# EAGLE design 5-de-7 (EAGLE 6.6.0)
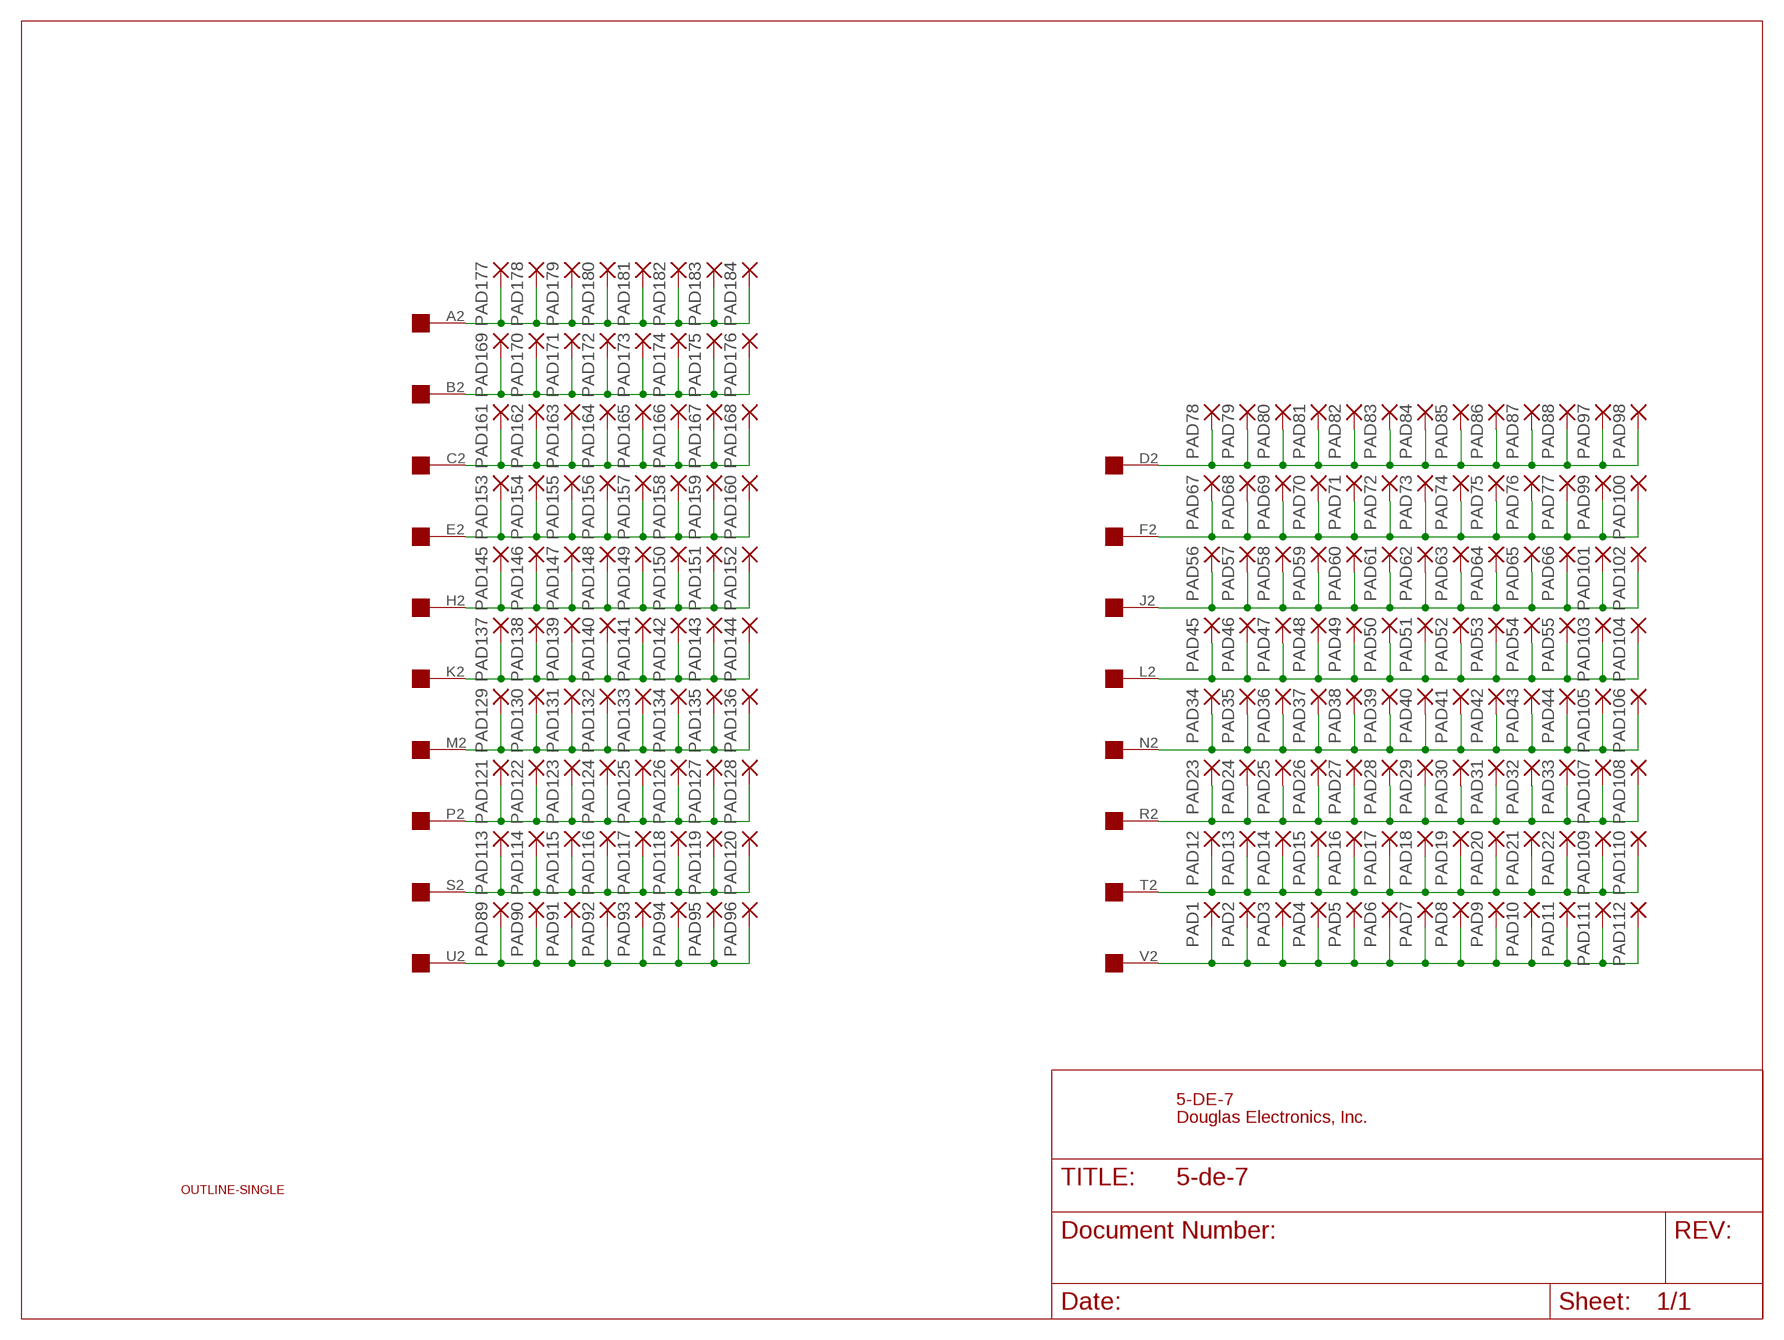
[diagram p0: schematic, sheet 1]

## Parts
PAD1  2,54/1,1  [2,54/1,1]
PAD2  2,54/1,1  [2,54/1,1]
PAD3  2,54/1,1  [2,54/1,1]
PAD4  2,54/1,1  [2,54/1,1]
PAD5  2,54/1,1  [2,54/1,1]
PAD6  2,54/1,1  [2,54/1,1]
PAD7  2,54/1,1  [2,54/1,1]
PAD8  2,54/1,1  [2,54/1,1]
PAD9  2,54/1,1  [2,54/1,1]
PAD10  2,54/1,1  [2,54/1,1]
PAD11  2,54/1,1  [2,54/1,1]
PAD12  2,54/1,1  [2,54/1,1]
PAD13  2,54/1,1  [2,54/1,1]
PAD14  2,54/1,1  [2,54/1,1]
PAD15  2,54/1,1  [2,54/1,1]
PAD16  2,54/1,1  [2,54/1,1]
PAD17  2,54/1,1  [2,54/1,1]
PAD18  2,54/1,1  [2,54/1,1]
PAD19  2,54/1,1  [2,54/1,1]
PAD20  2,54/1,1  [2,54/1,1]
PAD21  2,54/1,1  [2,54/1,1]
PAD22  2,54/1,1  [2,54/1,1]
PAD23  2,54/1,1  [2,54/1,1]
PAD24  2,54/1,1  [2,54/1,1]
PAD25  2,54/1,1  [2,54/1,1]
PAD26  2,54/1,1  [2,54/1,1]
PAD27  2,54/1,1  [2,54/1,1]
PAD28  2,54/1,1  [2,54/1,1]
PAD29  2,54/1,1  [2,54/1,1]
PAD30  2,54/1,1  [2,54/1,1]
PAD31  2,54/1,1  [2,54/1,1]
PAD32  2,54/1,1  [2,54/1,1]
PAD33  2,54/1,1  [2,54/1,1]
PAD34  2,54/1,1  [2,54/1,1]
PAD35  2,54/1,1  [2,54/1,1]
PAD36  2,54/1,1  [2,54/1,1]
PAD37  2,54/1,1  [2,54/1,1]
PAD38  2,54/1,1  [2,54/1,1]
PAD39  2,54/1,1  [2,54/1,1]
PAD40  2,54/1,1  [2,54/1,1]
PAD41  2,54/1,1  [2,54/1,1]
PAD42  2,54/1,1  [2,54/1,1]
PAD43  2,54/1,1  [2,54/1,1]
PAD44  2,54/1,1  [2,54/1,1]
PAD45  2,54/1,1  [2,54/1,1]
PAD46  2,54/1,1  [2,54/1,1]
PAD47  2,54/1,1  [2,54/1,1]
PAD48  2,54/1,1  [2,54/1,1]
PAD49  2,54/1,1  [2,54/1,1]
PAD50  2,54/1,1  [2,54/1,1]
PAD51  2,54/1,1  [2,54/1,1]
PAD52  2,54/1,1  [2,54/1,1]
PAD53  2,54/1,1  [2,54/1,1]
PAD54  2,54/1,1  [2,54/1,1]
PAD55  2,54/1,1  [2,54/1,1]
PAD56  2,54/1,1  [2,54/1,1]
PAD57  2,54/1,1  [2,54/1,1]
PAD58  2,54/1,1  [2,54/1,1]
PAD59  2,54/1,1  [2,54/1,1]
PAD60  2,54/1,1  [2,54/1,1]
PAD61  2,54/1,1  [2,54/1,1]
PAD62  2,54/1,1  [2,54/1,1]
PAD63  2,54/1,1  [2,54/1,1]
PAD64  2,54/1,1  [2,54/1,1]
PAD65  2,54/1,1  [2,54/1,1]
PAD66  2,54/1,1  [2,54/1,1]
PAD67  2,54/1,1  [2,54/1,1]
PAD68  2,54/1,1  [2,54/1,1]
PAD69  2,54/1,1  [2,54/1,1]
PAD70  2,54/1,1  [2,54/1,1]
PAD71  2,54/1,1  [2,54/1,1]
PAD72  2,54/1,1  [2,54/1,1]
PAD73  2,54/1,1  [2,54/1,1]
PAD74  2,54/1,1  [2,54/1,1]
PAD75  2,54/1,1  [2,54/1,1]
PAD76  2,54/1,1  [2,54/1,1]
PAD77  2,54/1,1  [2,54/1,1]
PAD78  2,54/1,1  [2,54/1,1]
PAD79  2,54/1,1  [2,54/1,1]
PAD80  2,54/1,1  [2,54/1,1]
PAD81  2,54/1,1  [2,54/1,1]
PAD82  2,54/1,1  [2,54/1,1]
PAD83  2,54/1,1  [2,54/1,1]
PAD84  2,54/1,1  [2,54/1,1]
PAD85  2,54/1,1  [2,54/1,1]
PAD86  2,54/1,1  [2,54/1,1]
PAD87  2,54/1,1  [2,54/1,1]
PAD88  2,54/1,1  [2,54/1,1]
PAD89  2,54/1,1  [2,54/1,1]
PAD90  2,54/1,1  [2,54/1,1]
PAD91  2,54/1,1  [2,54/1,1]
PAD92  2,54/1,1  [2,54/1,1]
PAD93  2,54/1,1  [2,54/1,1]
PAD94  2,54/1,1  [2,54/1,1]
PAD95  2,54/1,1  [2,54/1,1]
PAD96  2,54/1,1  [2,54/1,1]
PAD97  2,54/1,1  [2,54/1,1]
PAD98  2,54/1,1  [2,54/1,1]
PAD99  2,54/1,1  [2,54/1,1]
PAD100  2,54/1,1  [2,54/1,1]
PAD101  2,54/1,1  [2,54/1,1]
PAD102  2,54/1,1  [2,54/1,1]
PAD103  2,54/1,1  [2,54/1,1]
PAD104  2,54/1,1  [2,54/1,1]
PAD105  2,54/1,1  [2,54/1,1]
PAD106  2,54/1,1  [2,54/1,1]
PAD107  2,54/1,1  [2,54/1,1]
PAD108  2,54/1,1  [2,54/1,1]
PAD109  2,54/1,1  [2,54/1,1]
PAD110  2,54/1,1  [2,54/1,1]
PAD111  2,54/1,1  [2,54/1,1]
PAD112  2,54/1,1  [2,54/1,1]
PAD113  2,54/1,1  [2,54/1,1]
PAD114  2,54/1,1  [2,54/1,1]
PAD115  2,54/1,1  [2,54/1,1]
PAD116  2,54/1,1  [2,54/1,1]
PAD117  2,54/1,1  [2,54/1,1]
PAD118  2,54/1,1  [2,54/1,1]
PAD119  2,54/1,1  [2,54/1,1]
PAD120  2,54/1,1  [2,54/1,1]
PAD121  2,54/1,1  [2,54/1,1]
PAD122  2,54/1,1  [2,54/1,1]
PAD123  2,54/1,1  [2,54/1,1]
PAD124  2,54/1,1  [2,54/1,1]
PAD125  2,54/1,1  [2,54/1,1]
PAD126  2,54/1,1  [2,54/1,1]
PAD127  2,54/1,1  [2,54/1,1]
PAD128  2,54/1,1  [2,54/1,1]
PAD129  2,54/1,1  [2,54/1,1]
PAD130  2,54/1,1  [2,54/1,1]
PAD131  2,54/1,1  [2,54/1,1]
PAD132  2,54/1,1  [2,54/1,1]
PAD133  2,54/1,1  [2,54/1,1]
PAD134  2,54/1,1  [2,54/1,1]
PAD135  2,54/1,1  [2,54/1,1]
PAD136  2,54/1,1  [2,54/1,1]
PAD137  2,54/1,1  [2,54/1,1]
PAD138  2,54/1,1  [2,54/1,1]
PAD139  2,54/1,1  [2,54/1,1]
PAD140  2,54/1,1  [2,54/1,1]
PAD141  2,54/1,1  [2,54/1,1]
PAD142  2,54/1,1  [2,54/1,1]
PAD143  2,54/1,1  [2,54/1,1]
PAD144  2,54/1,1  [2,54/1,1]
PAD145  2,54/1,1  [2,54/1,1]
PAD146  2,54/1,1  [2,54/1,1]
PAD147  2,54/1,1  [2,54/1,1]
PAD148  2,54/1,1  [2,54/1,1]
PAD149  2,54/1,1  [2,54/1,1]
PAD150  2,54/1,1  [2,54/1,1]
PAD151  2,54/1,1  [2,54/1,1]
PAD152  2,54/1,1  [2,54/1,1]
PAD153  2,54/1,1  [2,54/1,1]
PAD154  2,54/1,1  [2,54/1,1]
PAD155  2,54/1,1  [2,54/1,1]
PAD156  2,54/1,1  [2,54/1,1]
PAD157  2,54/1,1  [2,54/1,1]
PAD158  2,54/1,1  [2,54/1,1]
PAD159  2,54/1,1  [2,54/1,1]
PAD160  2,54/1,1  [2,54/1,1]
PAD161  2,54/1,1  [2,54/1,1]
PAD162  2,54/1,1  [2,54/1,1]
PAD163  2,54/1,1  [2,54/1,1]
PAD164  2,54/1,1  [2,54/1,1]
PAD165  2,54/1,1  [2,54/1,1]
PAD166  2,54/1,1  [2,54/1,1]
PAD167  2,54/1,1  [2,54/1,1]
PAD168  2,54/1,1  [2,54/1,1]
PAD169  2,54/1,1  [2,54/1,1]
PAD170  2,54/1,1  [2,54/1,1]
PAD171  2,54/1,1  [2,54/1,1]
PAD172  2,54/1,1  [2,54/1,1]
PAD173  2,54/1,1  [2,54/1,1]
PAD174  2,54/1,1  [2,54/1,1]
PAD175  2,54/1,1  [2,54/1,1]
PAD176  2,54/1,1  [2,54/1,1]
PAD177  2,54/1,1  [2,54/1,1]
PAD178  2,54/1,1  [2,54/1,1]
PAD179  2,54/1,1  [2,54/1,1]
PAD180  2,54/1,1  [2,54/1,1]
PAD181  2,54/1,1  [2,54/1,1]
PAD182  2,54/1,1  [2,54/1,1]
PAD183  2,54/1,1  [2,54/1,1]
PAD184  2,54/1,1  [2,54/1,1]
U$2  OUTLINE-SINGLE  [SINGLE]
U$3  EDGE-1  [EDGE-CON1]

## Nets
A [abcehkmpsu]: PAD177.1(P) PAD178.1(P) PAD179.1(P) PAD180.1(P) PAD181.1(P) PAD182.1(P) PAD183.1(P) PAD184.1(P) U$3.A2
B [abcehkmpsu]: PAD169.1(P) PAD170.1(P) PAD171.1(P) PAD172.1(P) PAD173.1(P) PAD174.1(P) PAD175.1(P) PAD176.1(P) U$3.B2
C [abcehkmpsu]: PAD161.1(P) PAD162.1(P) PAD163.1(P) PAD164.1(P) PAD165.1(P) PAD166.1(P) PAD167.1(P) PAD168.1(P) U$3.C2
D: PAD78.1(P) PAD79.1(P) PAD80.1(P) PAD81.1(P) PAD82.1(P) PAD83.1(P) PAD84.1(P) PAD85.1(P) PAD86.1(P) PAD87.1(P) PAD88.1(P) PAD97.1(P) PAD98.1(P) U$3.D2
E [abcehkmpsu]: PAD153.1(P) PAD154.1(P) PAD155.1(P) PAD156.1(P) PAD157.1(P) PAD158.1(P) PAD159.1(P) PAD160.1(P) U$3.E2
F: PAD67.1(P) PAD68.1(P) PAD69.1(P) PAD70.1(P) PAD71.1(P) PAD72.1(P) PAD73.1(P) PAD74.1(P) PAD75.1(P) PAD76.1(P) PAD77.1(P) PAD99.1(P) PAD100.1(P) U$3.F2
H [abcehkmpsu]: PAD145.1(P) PAD146.1(P) PAD147.1(P) PAD148.1(P) PAD149.1(P) PAD150.1(P) PAD151.1(P) PAD152.1(P) U$3.H2
J: PAD56.1(P) PAD57.1(P) PAD58.1(P) PAD59.1(P) PAD60.1(P) PAD61.1(P) PAD62.1(P) PAD63.1(P) PAD64.1(P) PAD65.1(P) PAD66.1(P) PAD101.1(P) PAD102.1(P) U$3.J2
K [abcehkmpsu]: PAD137.1(P) PAD138.1(P) PAD139.1(P) PAD140.1(P) PAD141.1(P) PAD142.1(P) PAD143.1(P) PAD144.1(P) U$3.K2
L: PAD45.1(P) PAD46.1(P) PAD47.1(P) PAD48.1(P) PAD49.1(P) PAD50.1(P) PAD51.1(P) PAD52.1(P) PAD53.1(P) PAD54.1(P) PAD55.1(P) PAD103.1(P) PAD104.1(P) U$3.L2
M [abcehkmpsu]: PAD129.1(P) PAD130.1(P) PAD131.1(P) PAD132.1(P) PAD133.1(P) PAD134.1(P) PAD135.1(P) PAD136.1(P) U$3.M2
N: PAD34.1(P) PAD35.1(P) PAD36.1(P) PAD37.1(P) PAD38.1(P) PAD39.1(P) PAD40.1(P) PAD41.1(P) PAD42.1(P) PAD43.1(P) PAD44.1(P) PAD105.1(P) PAD106.1(P) U$3.N2
P [abcehkmpsu]: PAD121.1(P) PAD122.1(P) PAD123.1(P) PAD124.1(P) PAD125.1(P) PAD126.1(P) PAD127.1(P) PAD128.1(P) U$3.P2
R: PAD23.1(P) PAD24.1(P) PAD25.1(P) PAD26.1(P) PAD27.1(P) PAD28.1(P) PAD29.1(P) PAD30.1(P) PAD31.1(P) PAD32.1(P) PAD33.1(P) PAD107.1(P) PAD108.1(P) U$3.R2
S [abcehkmpsu]: PAD113.1(P) PAD114.1(P) PAD115.1(P) PAD116.1(P) PAD117.1(P) PAD118.1(P) PAD119.1(P) PAD120.1(P) U$3.S2
T: PAD12.1(P) PAD13.1(P) PAD14.1(P) PAD15.1(P) PAD16.1(P) PAD17.1(P) PAD18.1(P) PAD19.1(P) PAD20.1(P) PAD21.1(P) PAD22.1(P) PAD109.1(P) PAD110.1(P) U$3.T2
U [abcehkmpsu]: PAD89.1(P) PAD90.1(P) PAD91.1(P) PAD92.1(P) PAD93.1(P) PAD94.1(P) PAD95.1(P) PAD96.1(P) U$3.U2
V: PAD1.1(P) PAD2.1(P) PAD3.1(P) PAD4.1(P) PAD5.1(P) PAD6.1(P) PAD7.1(P) PAD8.1(P) PAD9.1(P) PAD10.1(P) PAD11.1(P) PAD111.1(P) PAD112.1(P) U$3.V2

## Notes on the sheet
- 5-DE-7
- Douglas Electronics, Inc.

## Library data of the parts
PAD1-PAD184 = wirepad:2,54/1,1: THROUGH-HOLE PAD
U$2 = dec-con:OUTLINE-*: Board outlines for DEC boards.
U$3 = dec-con:EDGE-1: Single-Sided DEC Edge Connector -- (side 2)

## Net classes
0 default: width 0.762 mm
1 abcehkmpsu: width 1.016 mm

## Board
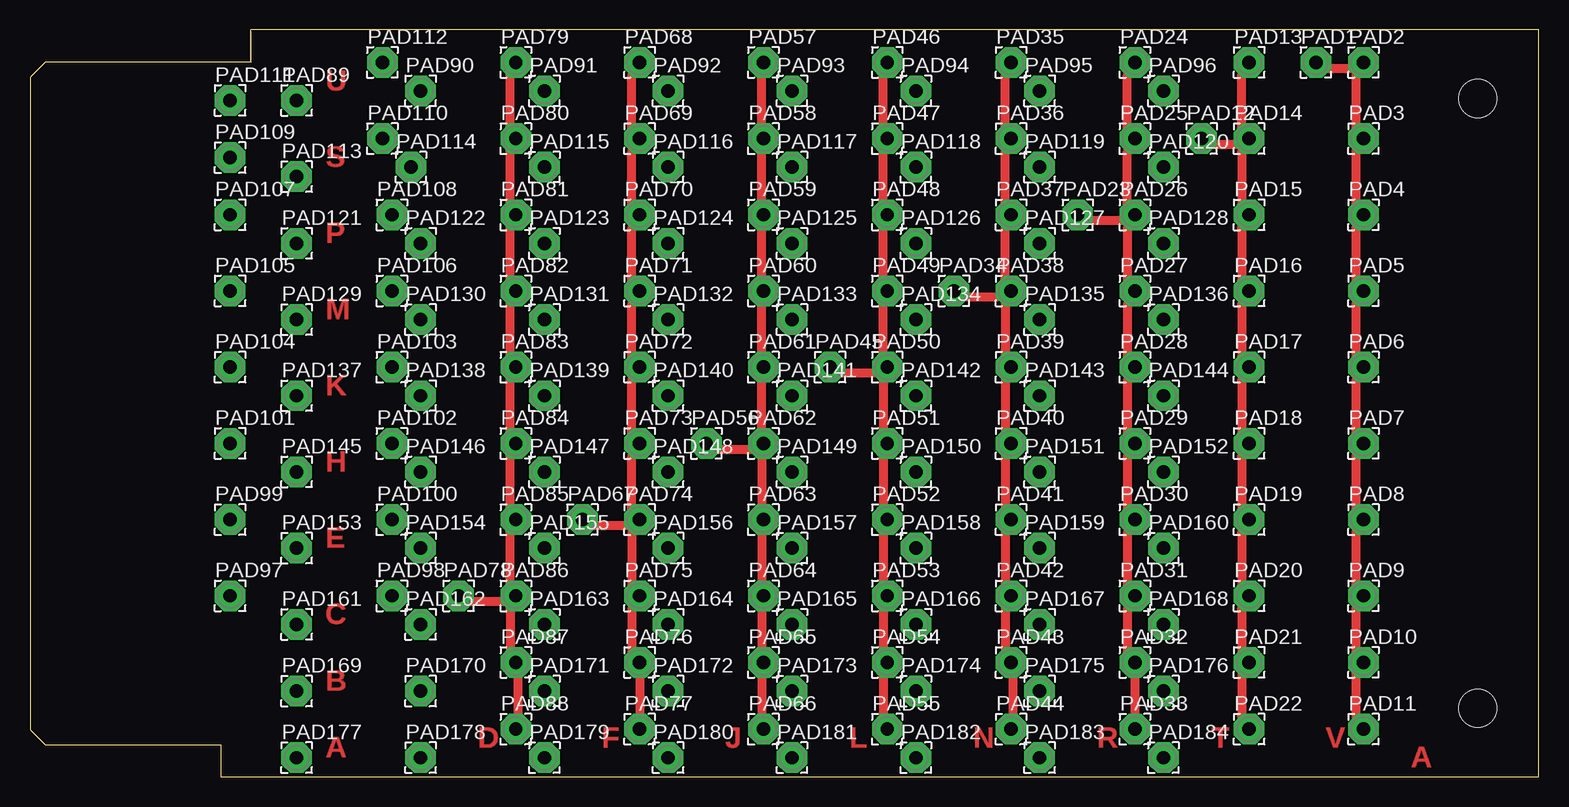
[diagram p1: board, top side]
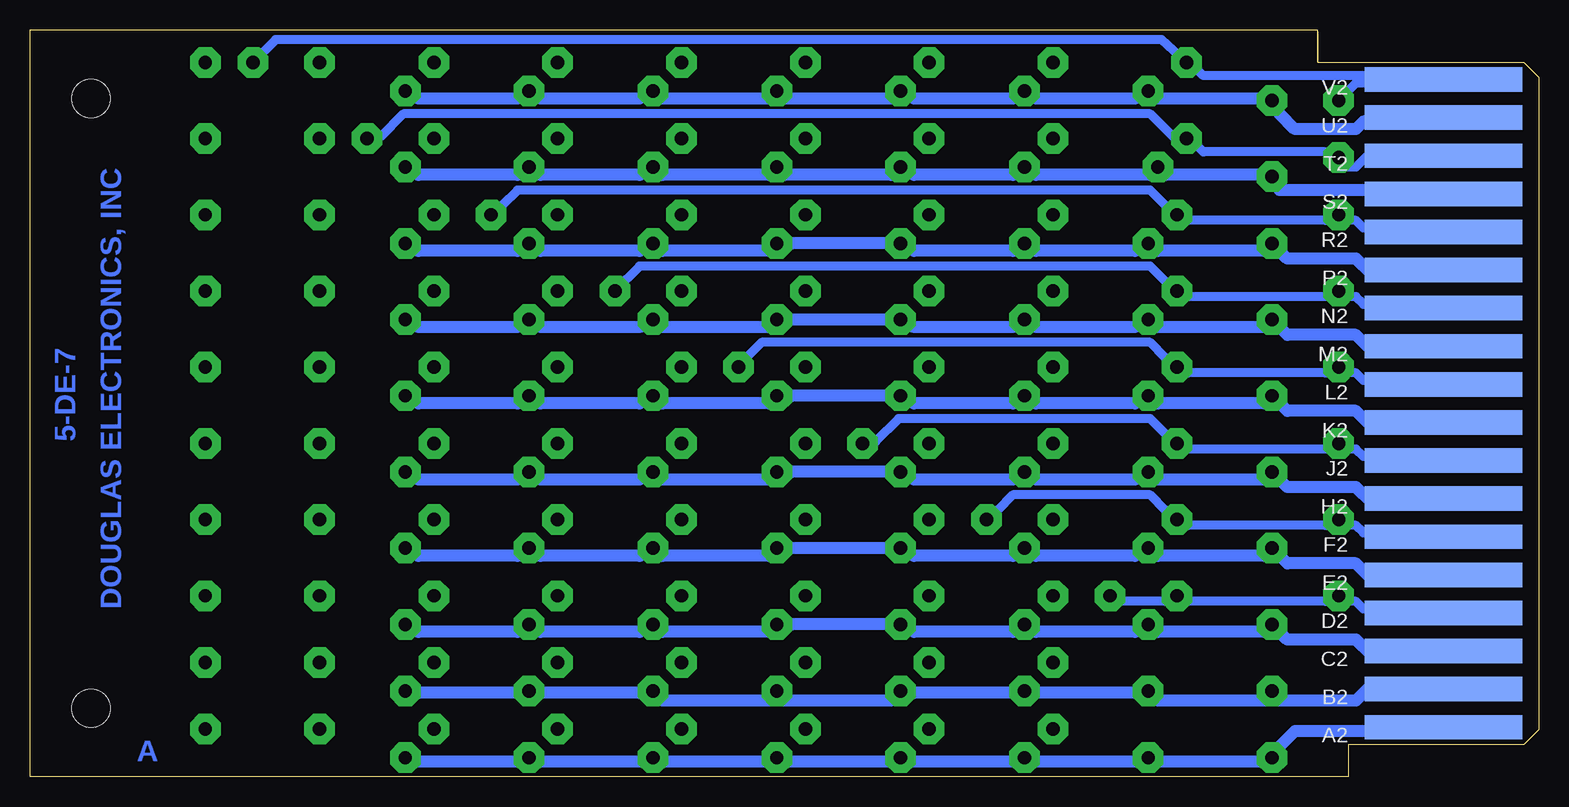
[diagram p2: board, bottom side, seen from below]

Size 125.73 x 62.23 mm. Coordinates in mm from the lower left corner, seen from the top.
Copper layers (1*16): Top 0.035mm / dielectric 1.5mm / Bottom 0.035mm
Design rules "default": minimum track width 10mil, minimum drill 24mil, track to track 8mil, track to pad 8mil, pad to pad 8mil, via to via 8mil, smd to smd 8mil, copper to edge 10mil, drill to drill 8mil, minimum pad ring 10mil, minimum via ring 8mil, stop-mask expansion 4mil, vias tented up to drill 0mil, thermal gap 10mil

### Footprints (pad centres in the part's own frame; a part is rotated, then mirrored left to right if it is on the bottom)
2,54/1,1 = drill 1.118 pad 2.54 octagon: 1 0,0
SINGLE = hole 3.175: 120.65,56.515; 120.65,5.715
EDGE-CON1 = smd 13.106 x 2.032 bottom: A2 7.938,4.128; B2 7.938,7.303; C2 7.938,10.477; D2 7.938,13.652; E2 7.938,16.828; F2 7.938,20.003; H2 7.938,23.177; J2 7.938,26.352; K2 7.938,29.527; L2 7.938,32.703; M2 7.938,35.877; N2 7.938,39.053; P2 7.938,42.227; R2 7.938,45.403; S2 7.938,48.578; T2 7.938,51.752; U2 7.938,54.928; V2 7.938,58.102

### Placement (x,y rotation side)
PAD1  107.16,59.53 0 top
PAD2  111.13,59.53 0 top
PAD3  111.13,53.18 0 top
PAD4  111.13,46.83 0 top
PAD5  111.13,40.48 0 top
PAD6  111.13,34.13 0 top
PAD7  111.13,27.78 0 top
PAD8  111.13,21.43 0 top
PAD9  111.13,15.08 0 top
PAD10  111.13,9.53 0 top
PAD11  111.13,3.97 0 top
PAD12  97.63,53.18 0 top
PAD13  101.6,59.53 0 top
PAD14  101.6,53.18 0 top
PAD15  101.6,46.83 0 top
PAD16  101.6,40.48 0 top
PAD17  101.6,34.13 0 top
PAD18  101.6,27.78 0 top
PAD19  101.6,21.43 0 top
PAD20  101.6,15.08 0 top
PAD21  101.6,9.53 0 top
PAD22  101.6,3.97 0 top
PAD23  87.31,46.83 0 top
PAD24  92.08,59.53 0 top
PAD25  92.08,53.18 0 top
PAD26  92.08,46.83 0 top
PAD27  92.08,40.48 0 top
PAD28  92.08,34.13 0 top
PAD29  92.08,27.78 0 top
PAD30  92.08,21.43 0 top
PAD31  92.08,15.08 0 top
PAD32  92.08,9.53 0 top
PAD33  92.08,3.97 0 top
PAD34  76.99,40.48 0 top
PAD35  81.76,59.53 0 top
PAD36  81.76,53.18 0 top
PAD37  81.76,46.83 0 top
PAD38  81.76,40.48 0 top
PAD39  81.76,34.13 0 top
PAD40  81.76,27.78 0 top
PAD41  81.76,21.43 0 top
PAD42  81.76,15.08 0 top
PAD43  81.76,9.53 0 top
PAD44  81.76,3.97 0 top
PAD45  66.68,34.13 0 top
PAD46  71.44,59.53 0 top
PAD47  71.44,53.18 0 top
PAD48  71.44,46.83 0 top
PAD49  71.44,40.48 0 top
PAD50  71.44,34.13 0 top
PAD51  71.44,27.78 0 top
PAD52  71.44,21.43 0 top
PAD53  71.44,15.08 0 top
PAD54  71.44,9.53 0 top
PAD55  71.44,3.97 0 top
PAD56  56.36,27.78 0 top
PAD57  61.12,59.53 0 top
PAD58  61.12,53.18 0 top
PAD59  61.12,46.83 0 top
PAD60  61.12,40.48 0 top
PAD61  61.12,34.13 0 top
PAD62  61.12,27.78 0 top
PAD63  61.12,21.43 0 top
PAD64  61.12,15.08 0 top
PAD65  61.12,9.53 0 top
PAD66  61.12,3.97 0 top
PAD67  46.04,21.43 0 top
PAD68  50.8,59.53 0 top
PAD69  50.8,53.18 0 top
PAD70  50.8,46.83 0 top
PAD71  50.8,40.48 0 top
PAD72  50.8,34.13 0 top
PAD73  50.8,27.78 0 top
PAD74  50.8,21.43 0 top
PAD75  50.8,15.08 0 top
PAD76  50.8,9.53 0 top
PAD77  50.8,3.97 0 top
PAD78  35.72,15.08 0 top
PAD79  40.48,59.53 0 top
PAD80  40.48,53.18 0 top
PAD81  40.48,46.83 0 top
PAD82  40.48,40.48 0 top
PAD83  40.48,34.13 0 top
PAD84  40.48,27.78 0 top
PAD85  40.48,21.43 0 top
PAD86  40.48,15.08 0 top
PAD87  40.48,9.53 0 top
PAD88  40.48,3.97 0 top
PAD89  22.23,56.36 0 top
PAD90  32.54,57.15 0 top
PAD91  42.86,57.15 0 top
PAD92  53.18,57.15 0 top
PAD93  63.5,57.15 0 top
PAD94  73.82,57.15 0 top
PAD95  84.14,57.15 0 top
PAD96  94.46,57.15 0 top
PAD97  16.67,15.08 0 top
PAD98  30.16,15.08 0 top
PAD99  16.67,21.43 0 top
PAD100  30.16,21.43 0 top
PAD101  16.67,27.78 0 top
PAD102  30.16,27.78 0 top
PAD103  30.16,34.13 0 top
PAD104  16.67,34.13 0 top
PAD105  16.67,40.48 0 top
PAD106  30.16,40.48 0 top
PAD107  16.67,46.83 0 top
PAD108  30.16,46.83 0 top
PAD109  16.67,51.59 0 top
PAD110  29.37,53.18 0 top
PAD111  16.67,56.36 0 top
PAD112  29.37,59.53 0 top
PAD113  22.23,50.01 0 top
PAD114  31.75,50.8 0 top
PAD115  42.86,50.8 0 top
PAD116  53.18,50.8 0 top
PAD117  63.5,50.8 0 top
PAD118  73.82,50.8 0 top
PAD119  84.14,50.8 0 top
PAD120  94.46,50.8 0 top
PAD121  22.23,44.45 0 top
PAD122  32.54,44.45 0 top
PAD123  42.86,44.45 0 top
PAD124  53.18,44.45 0 top
PAD125  63.5,44.45 0 top
PAD126  73.82,44.45 0 top
PAD127  84.14,44.45 0 top
PAD128  94.46,44.45 0 top
PAD129  22.23,38.1 0 top
PAD130  32.54,38.1 0 top
PAD131  42.86,38.1 0 top
PAD132  53.18,38.1 0 top
PAD133  63.5,38.1 0 top
PAD134  73.82,38.1 0 top
PAD135  84.14,38.1 0 top
PAD136  94.46,38.1 0 top
PAD137  22.23,31.75 0 top
PAD138  32.54,31.75 0 top
PAD139  42.86,31.75 0 top
PAD140  53.18,31.75 0 top
PAD141  63.5,31.75 0 top
PAD142  73.82,31.75 0 top
PAD143  84.14,31.75 0 top
PAD144  94.46,31.75 0 top
PAD145  22.23,25.4 0 top
PAD146  32.54,25.4 0 top
PAD147  42.86,25.4 0 top
PAD148  53.18,25.4 0 top
PAD149  63.5,25.4 0 top
PAD150  73.82,25.4 0 top
PAD151  84.14,25.4 0 top
PAD152  94.46,25.4 0 top
PAD153  22.23,19.05 0 top
PAD154  32.54,19.05 0 top
PAD155  42.86,19.05 0 top
PAD156  53.18,19.05 0 top
PAD157  63.5,19.05 0 top
PAD158  73.82,19.05 0 top
PAD159  84.14,19.05 0 top
PAD160  94.46,19.05 0 top
PAD161  22.23,12.7 0 top
PAD162  32.54,12.7 0 top
PAD163  42.86,12.7 0 top
PAD164  53.18,12.7 0 top
PAD165  63.5,12.7 0 top
PAD166  73.82,12.7 0 top
PAD167  84.14,12.7 0 top
PAD168  94.46,12.7 0 top
PAD169  22.23,7.14 0 top
PAD170  32.54,7.14 0 top
PAD171  42.86,7.14 0 top
PAD172  53.18,7.14 0 top
PAD173  63.5,7.14 0 top
PAD174  73.82,7.14 0 top
PAD175  84.14,7.14 0 top
PAD176  94.46,7.14 0 top
PAD177  22.23,1.59 0 top
PAD178  32.54,1.59 0 top
PAD179  42.86,1.59 0 top
PAD180  53.18,1.59 0 top
PAD181  63.5,1.59 0 top
PAD182  73.82,1.59 0 top
PAD183  84.14,1.59 0 top
PAD184  94.46,1.59 0 top
U$2  0,0 0 top
U$3  0,0 0 top

### Tracks (layer width: path | path; a pad name or v marks a point on that pad's centre or on a via)
A
  Bottom 1.016: U$3.A2 13.97,3.81 20.32,3.81 21.59,2.54 PAD177.1 22.86,1.27 31.75,1.27 PAD178.1 33.66,1.27 41.91,1.27 PAD179.1 43.82,1.27 52.07,1.27 PAD180.1 53.98,1.27 62.87,1.27 PAD181.1 64.14,1.27 73.03,1.27 PAD182.1 74.93,1.27 83.19,1.27 PAD183.1 85.09,1.27 93.35,1.27 PAD184.1
B
  Bottom 1.016: U$3.B2 13.97,7.62 15.24,6.35 21.59,6.35 PAD169.1 22.86,6.35 31.75,6.35 PAD170.1 33.66,6.99 41.91,6.99 PAD171.1 43.82,6.99 52.07,6.99 PAD172.1 53.98,6.35 62.87,6.35 PAD173.1 64.14,6.35 73.03,6.35 PAD174.1 74.93,6.99 83.19,6.99 PAD175.1 85.09,6.99 93.35,6.99 PAD176.1
C
  Bottom 1.016: U$3.C2 13.97,10.16 15.24,11.43 20.96,11.43 21.59,12.07 PAD161.1 22.86,12.07 31.75,12.07 PAD162.1 33.66,12.07 41.91,12.07 PAD163.1 43.82,12.07 52.07,12.07 PAD164.1 53.98,12.7 62.23,12.7 PAD165.1 64.14,12.07 73.03,12.07 PAD166.1 74.93,12.07 83.19,12.07 PAD167.1 85.09,12.07 93.35,12.07 PAD168.1
D
  Top 0.762: PAD79.1 40.01,58.42 40.01,53.98 PAD80.1 40.01,52.07 40.01,47.63 PAD81.1 40.01,45.72 40.01,41.28 PAD82.1 40.01,39.37 40.01,34.93 PAD83.1 40.01,33.02 40.01,28.58 PAD84.1 40.01,26.67 40.01,22.23 PAD85.1 40.01,20.32 40.01,15.88 PAD86.1 | PAD88.1 40.64,5.08 40.64,8.89 PAD87.1 40.01,10.16 40.01,13.97 PAD86.1 | PAD86.1 39.37,14.61 36.83,14.61 PAD78.1
  Bottom 0.762: U$3.D2 13.97,13.97 14.61,13.97 15.24,14.61 15.88,14.61 PAD97.1 17.78,14.61 29.21,14.61 PAD98.1 31.12,14.61 34.93,14.61 PAD78.1
E
  Bottom 1.016: U$3.E2 12.7,16.51 13.97,16.51 15.24,17.78 20.96,17.78 21.59,18.42 PAD153.1 22.86,18.42 31.75,18.42 PAD154.1 33.66,18.42 41.91,18.42 PAD155.1 43.82,18.42 52.07,18.42 PAD156.1 53.98,19.05 62.23,19.05 PAD157.1 64.14,18.42 73.03,18.42 PAD158.1 74.93,18.42 83.19,18.42 PAD159.1 85.09,18.42 93.35,18.42 PAD160.1
F
  Top 0.762: PAD77.1 PAD76.1 50.17,10.16 50.17,13.97 PAD75.1 50.17,15.88 50.17,20.32 PAD74.1 | PAD67.1 46.99,20.96 50.17,20.96 PAD74.1 | PAD74.1 50.17,22.23 50.17,26.67 PAD73.1 50.17,28.58 50.17,33.02 PAD72.1 50.17,34.93 50.17,39.37 PAD71.1 50.17,41.28 50.17,45.72 PAD70.1 50.17,47.63 50.17,52.07 PAD69.1 50.17,53.98 50.17,58.42 PAD68.1
  Bottom 0.762: U$3.F2 13.97,20.32 14.61,20.32 15.24,20.96 15.88,20.96 PAD99.1 17.78,20.96 29.21,20.96 PAD100.1 31.12,22.23 32.39,23.5 43.82,23.5 45.09,22.23 PAD67.1
H
  Bottom 1.016: U$3.H2 13.97,22.86 15.24,24.13 20.96,24.13 21.59,24.77 PAD145.1 22.86,24.77 31.75,24.77 PAD146.1 33.66,24.77 41.91,24.77 PAD147.1 43.82,24.77 52.07,24.77 PAD148.1 53.98,25.4 62.23,25.4 PAD149.1 64.14,24.77 73.03,24.77 PAD150.1 74.93,24.77 83.19,24.77 PAD151.1 85.09,24.77 93.35,24.77 PAD152.1
J
  Top 0.762: PAD66.1 60.96,5.08 60.96,8.89 PAD65.1 60.96,10.16 60.96,13.97 PAD64.1 60.96,15.88 60.96,20.32 PAD63.1 60.96,22.23 60.96,26.67 PAD62.1 | PAD56.1 57.15,27.31 60.33,27.31 PAD62.1 | PAD62.1 60.96,28.58 60.96,33.02 PAD61.1 60.96,34.93 60.96,39.37 PAD60.1 60.96,41.28 60.96,45.72 PAD59.1 60.96,47.63 60.96,52.07 PAD58.1 60.96,53.98 60.96,58.42 PAD57.1
  Bottom 0.762: U$3.J2 13.97,26.67 14.61,26.67 15.24,27.31 15.88,27.31 PAD101.1 17.78,27.31 29.21,27.31 PAD102.1 31.12,28.58 32.39,29.85 53.34,29.85 55.25,27.94 PAD56.1
K
  Bottom 1.016: U$3.K2 13.97,29.21 15.24,30.48 20.96,30.48 21.59,31.12 PAD137.1 22.86,31.12 31.75,31.12 PAD138.1 33.66,31.12 41.91,31.12 PAD139.1 43.82,31.12 52.07,31.12 PAD140.1 53.98,31.75 62.23,31.75 PAD141.1 64.14,31.12 73.03,31.12 PAD142.1 74.93,31.12 83.19,31.12 PAD143.1 85.09,31.12 93.35,31.12 PAD144.1
L
  Top 0.762: PAD55.1 71.12,5.08 71.12,8.89 PAD54.1 71.12,10.16 71.12,13.97 PAD53.1 71.12,15.88 71.12,20.32 PAD52.1 71.12,22.23 71.12,26.67 PAD51.1 71.12,28.58 71.12,33.02 PAD50.1 | PAD45.1 67.31,33.66 70.49,33.66 PAD50.1 | PAD50.1 71.12,34.93 71.12,39.37 PAD49.1 71.12,41.28 71.12,45.72 PAD48.1 71.12,47.63 71.12,52.07 PAD47.1 71.12,53.98 71.12,58.42 PAD46.1
  Bottom 0.762: U$3.L2 12.7,33.02 14.61,33.02 15.24,33.66 15.88,33.66 PAD104.1 17.78,33.66 29.21,33.66 PAD103.1 31.12,34.93 32.39,36.2 64.77,36.2 66.04,34.93 PAD45.1
M
  Bottom 1.016: U$3.M2 13.97,35.56 15.24,36.83 20.96,36.83 21.59,37.47 PAD129.1 22.86,37.47 31.75,37.47 PAD130.1 33.66,37.47 41.91,37.47 PAD131.1 43.82,37.47 52.07,37.47 PAD132.1 53.98,38.1 62.23,38.1 PAD133.1 64.14,37.47 73.03,37.47 PAD134.1 74.93,37.47 83.19,37.47 PAD135.1 85.09,37.47 93.35,37.47 PAD136.1
N
  Top 0.762: PAD34.1 78.11,40.01 80.65,40.01 PAD38.1 | PAD38.1 81.28,41.28 81.28,45.72 PAD37.1 81.28,47.63 81.28,52.07 PAD36.1 81.28,53.98 81.28,58.42 PAD35.1 | PAD44.1 81.92,5.08 81.92,8.89 PAD43.1 81.28,10.16 81.28,13.97 PAD42.1 81.28,15.88 81.28,20.32 PAD41.1 81.28,22.23 81.28,26.67 PAD40.1 81.28,28.58 81.28,33.02 PAD39.1 81.28,34.93 81.28,39.37 PAD38.1
  Bottom 0.762: U$3.N2 13.97,39.37 14.61,39.37 15.24,40.01 15.88,40.01 PAD105.1 17.78,40.01 29.21,40.01 PAD106.1 31.12,41.28 32.39,42.55 74.93,42.55 PAD34.1
P
  Bottom 1.016: U$3.P2 13.97,41.91 15.24,43.18 20.96,43.18 21.59,43.82 PAD121.1 22.86,43.82 31.75,43.82 PAD122.1 33.66,43.82 41.91,43.82 PAD123.1 43.82,43.82 52.07,43.82 PAD124.1 53.98,44.45 62.23,44.45 PAD125.1 64.14,43.82 73.03,43.82 PAD126.1 74.93,43.82 83.19,43.82 PAD127.1 85.09,43.82 93.35,43.82 PAD128.1
R
  Top 0.762: PAD23.1 88.27,46.36 91.44,46.36 PAD26.1 | PAD26.1 91.44,47.63 91.44,52.07 PAD25.1 91.44,53.98 91.44,58.42 PAD24.1 | PAD33.1 PAD32.1 91.44,10.16 91.44,13.97 PAD31.1 91.44,15.88 91.44,20.32 PAD30.1 91.44,22.23 91.44,26.67 PAD29.1 91.44,28.58 91.44,33.02 PAD28.1 91.44,34.93 91.44,39.37 PAD27.1 91.44,41.28 91.44,45.72 PAD26.1
  Bottom 0.762: U$3.R2 13.97,45.72 14.61,45.72 15.24,46.36 15.88,46.36 PAD107.1 17.78,46.36 29.21,46.36 PAD108.1 31.12,47.63 32.39,48.9 85.09,48.9 86.36,47.63 PAD23.1
S
  Bottom 1.016: U$3.S2 13.97,48.9 21.59,48.9 PAD113.1 22.86,50.17 31.12,50.17 PAD114.1 32.39,50.17 41.91,50.17 PAD115.1 43.82,50.17 52.07,50.17 PAD116.1 53.98,50.17 62.87,50.17 PAD117.1 64.14,50.17 73.03,50.17 PAD118.1 74.93,50.17 83.19,50.17 PAD119.1 85.09,50.17 93.35,50.17 PAD120.1
T
  Top 0.762: PAD12.1 98.43,52.71 100.97,52.71 PAD14.1 | PAD13.1 100.97,58.42 100.97,53.98 PAD14.1 | PAD22.1 100.97,5.08 100.97,8.89 PAD21.1 100.97,10.16 100.97,13.97 PAD20.1 100.97,15.88 100.97,20.32 PAD19.1 100.97,22.23 100.97,26.67 PAD18.1 100.97,28.58 100.97,33.02 PAD17.1 100.97,34.93 100.97,39.37 PAD16.1 100.97,41.28 100.97,45.72 PAD15.1 100.97,47.63 100.97,52.07 PAD14.1
  Bottom 0.762: U$3.T2 13.97,52.07 15.24,50.8 15.88,50.8 PAD109.1 17.78,52.07 27.94,52.07 28.58,52.71 PAD110.1 30.48,53.34 32.39,55.25 94.62,55.25 96.52,53.34 PAD12.1
U
  Bottom 1.016: U$3.U2 13.97,54.61 14.61,54.61 15.24,53.98 20.32,53.98 21.59,55.25 PAD89.1 22.86,56.52 31.75,56.52 PAD90.1 33.66,56.52 41.91,56.52 PAD91.1 43.82,56.52 52.07,56.52 PAD92.1 53.98,56.52 62.87,56.52 PAD93.1 64.14,56.52 73.03,56.52 PAD94.1 74.93,56.52 83.19,56.52 PAD95.1 85.09,56.52 93.35,56.52 PAD96.1
V
  Top 0.762: PAD11.1 110.49,5.08 110.49,8.89 PAD10.1 110.49,10.16 110.49,13.97 PAD9.1 110.49,15.88 110.49,20.32 PAD8.1 110.49,22.23 110.49,26.67 PAD7.1 110.49,28.58 110.49,33.02 PAD6.1 110.49,34.93 110.49,39.37 PAD5.1 110.49,41.28 110.49,45.72 PAD4.1 110.49,47.63 110.49,52.07 PAD3.1 110.49,53.98 110.49,58.42 PAD2.1 110.49,59.06 107.95,59.06 PAD1.1
  Bottom 0.762: PAD111.1 15.24,57.79 13.97,57.79 U$3.V2 13.97,58.42 27.94,58.42 28.58,59.06 PAD112.1 31.43,61.44 31.75,61.44 105.25,61.44 PAD1.1 | PAD1.1

### Text on the board
Top: U | S | P | M | K | H | E | C | B | A | A | D | F | J | L | N | R | T | V
Bottom: 5-DE-7 | DOUGLAS ELECTRONICS, INC | A